# Altium schematic sheet KorszeInterfaces.SchDoc
size A4
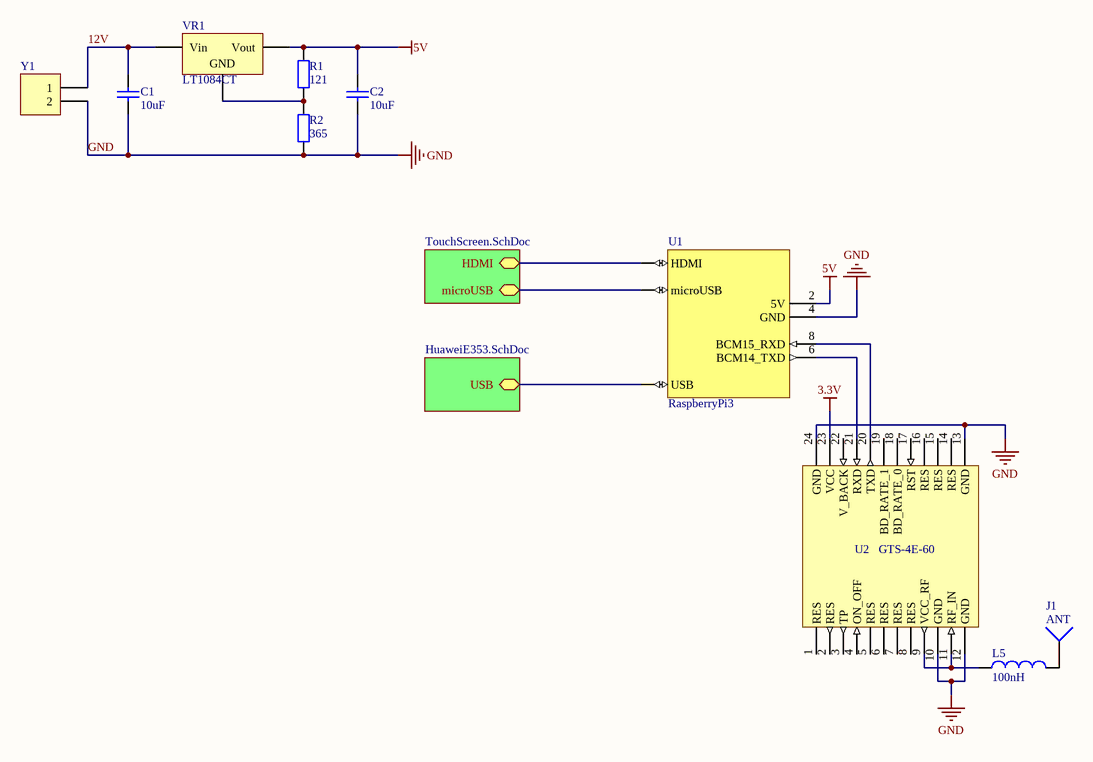
[diagram p0: KorszeInterfaces.SchDoc]

## Parts
C1  10uF  [RAD-0.3]
C2  10uF  [RAD-0.3]
J1  ANT  [PIN1]
L5  100nH  [0402-A]
R1  121  [AXIAL-0.4]
R2  365  [AXIAL-0.4]
U1  RaspberryPi3
U2  GTS-4E-60
VR1  LT1084CT  [TO-220-AB]
Y1  Header 2H  [HDR1X2H]  (value not drawn)

## Sub-sheets
Designator = HuaweiE353.SchDoc: USB (bidir)
Designator = TouchScreen.SchDoc: HDMI (bidir), microUSB (bidir)

## Nets
3.3V: U2.23(VCC)
5V: C2.2 R1.2 U1.2(5V) VR1.3(Vout)
GND: C1.1 C2.1 R2.1 U1.4(GND) U2.10(GND) U2.12(GND) U2.13(GND) U2.24(GND) Y1.2
12V: C1.2 VR1.1(Vin) Y1.1
NetJ1_1: J1.1 L5.2
NetL5_1: L5.1 U2.9(VCC_RF) U2.11(RF_IN)
NetR1_1: R1.1 R2.2 VR1.2(GND)
NetU1_6: U1.6(BCM14_TXD) U2.21(RXD)
NetU1_8: U1.8(BCM15_RXD) U2.20(TXD)
NetU1_?1: U1.?1(HDMI) ; sheet Designator/HDMI
NetU1_?2: U1.?2(microUSB) ; sheet Designator/microUSB
NetU1_?3: U1.?3(USB) ; sheet Designator/USB

Not connected (* = marked no-connect by the designer): U2 1(RES) 2(RES) 3(TP) 4(ON_OFF) 5(RES) 6(RES) 7(RES) 8(RES) 14(RES) 15(RES) 16(RES) 17(RST) 18(BD_RATE_0) 19(BD_RATE_1) 22(V_BACK)

## Library data of the parts
C1 C2 = Cap: Capacitor; Published: 8-Jun-2000; LatestRevisionDate: 17-Jul-2002; LatestRevisionNote: Re-released for DXP Platform.; PackageReference: RAD-0.3; Publisher: Altium Limited; PackageDescription: Radial Cap, Thru-Hole; 2 Leads; 0.3 in Pin Spacing; Value: 10uF
J1 = Socket: LatestRevisionDate: 17-Jul-2002; LatestRevisionNote: Re-released for DXP Platform.; Publisher: Altium Limited
L5 = Inductor: Code_IEC: 1005; Published: 8-Jun-2000; LatestRevisionDate: 29-May-2009; LatestRevisionNote: IPC-7351 Footprint Added.; PackageReference: 0402-A; Publisher: Altium Limited; PackageDescription: Chip Inductor; Code_JEITA: 0402; Value: 100nH
R1 R2 = Res2: Resistor; Published: 8-Jun-2000; LatestRevisionDate: 17-Jul-2002; LatestRevisionNote: Re-released for DXP Platform.; PackageReference: AXIAL-0.4; Publisher: Altium Limited; PackageDescription: Axial Device, Thru-Hole; 2 Leads; 0.4 in Pin Spacing
  R1: Value: 121
  R2: Value: 365
U2 = GTS-4E-60: FIBOCOM GTS-4E-60, GPS Module
VR1 = Volt Reg: Voltage Regulator; Published: 24-Mar-1999; LatestRevisionDate: 29-May-2009; LatestRevisionNote: IPC-7351 Footprint Added.; PackageReference: D2PAK; Publisher: Altium Limited; PackageDescription: 3-Pin Transistor Outline Package 2.54 mm Pitch, 15.1 mm Lead Span
Y1 = Header 2H: Header, 2-Pin, Right Angle; LatestRevisionDate: 17-Jul-2002; LatestRevisionNote: Re-released for DXP Platform.; Publisher: Altium Limited